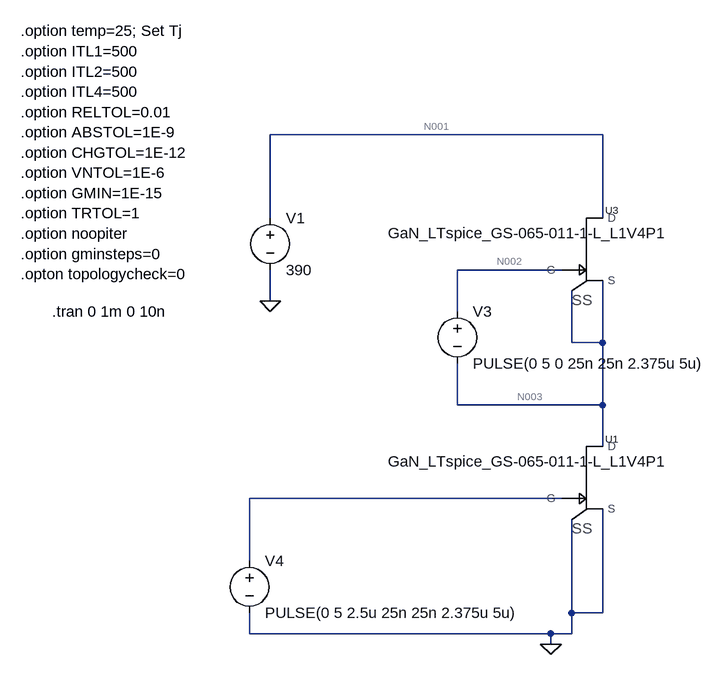
[diagram p0: schematic HB_TEST_GAN.asc]
HB_TEST_GAN.asc, the LTspice schematic file:
Version 4
SHEET 1 880 680
WIRE 320 -256 -192 -256
WIRE -192 -128 -192 -256
WIRE 320 -128 320 -256
WIRE 256 -48 96 -48
WIRE -192 0 -192 -48
WIRE 96 16 96 -48
WIRE 272 64 272 -16
WIRE 320 64 320 -32
WIRE 320 64 272 64
WIRE 96 160 96 96
WIRE 320 160 320 64
WIRE 320 160 96 160
WIRE 320 224 320 160
WIRE 256 304 -224 304
WIRE -224 400 -224 304
WIRE 272 480 272 336
WIRE 320 480 320 320
WIRE 320 480 272 480
WIRE -224 512 -224 480
WIRE 240 512 -224 512
WIRE 272 512 272 480
WIRE 272 512 240 512
WIRE 240 528 240 512
FLAG 240 528 0
FLAG -192 0 0
SYMBOL voltage 96 0 R0
WINDOW 123 0 0 Left 0
WINDOW 39 0 0 Left 0
SYMATTR InstName V3
SYMATTR Value PULSE(0 5 0 25n 25n 2.375u 5u)
SYMBOL voltage -224 384 R0
WINDOW 123 0 0 Left 0
WINDOW 39 0 0 Left 0
SYMATTR InstName V4
SYMATTR Value PULSE(0 5 2.5u 25n 25n 2.375u 5u)
SYMBOL voltage -192 -144 R0
WINDOW 123 0 0 Left 0
WINDOW 39 0 0 Left 0
SYMATTR InstName V1
SYMATTR Value 390
SYMBOL GaNSystems\\GaN_LTspice_GS-065-011-1-L_L1V4P1 272 -80 R0
SYMATTR InstName U3
SYMBOL GaNSystems\\GaN_LTspice_GS-065-011-1-L_L1V4P1 272 272 R0
SYMATTR InstName U1
TEXT -528 16 Left 2 !.tran 0 1m 0 10n
TEXT -576 -416 Left 2 !.option temp=25; Set Tj\n.option ITL1=500\n.option ITL2=500\n.option ITL4=500\n.option RELTOL=0.01\n.option ABSTOL=1E-9\n.option CHGTOL=1E-12\n.option VNTOL=1E-6\n.option GMIN=1E-15\n.option TRTOL=1\n.option noopiter\n.option gminsteps=0\n.opton topologycheck=0

The netlist it stands for:
* HB_TEST_GAN.asc
V3 N002 N003 PULSE(0 5 0 25n 25n 2.375u 5u)
V4 N004 0 PULSE(0 5 2.5u 25n 25n 2.375u 5u)
V1 N001 0 390
XU3 N002 N001 N003 N003 GaN_LTspice_GS-065-011-1-L_L1V4P1  ; pins G D S SS
XU1 N004 N003 0 0 GaN_LTspice_GS-065-011-1-L_L1V4P1  ; pins G D S SS
.tran 0 1m 0 10n
.option temp=25; Set Tj
.option ITL1=500
.option ITL2=500
.option ITL4=500
.option RELTOL=0.01
.option ABSTOL=1E-9
.option CHGTOL=1E-12
.option VNTOL=1E-6
.option GMIN=1E-15
.option TRTOL=1
.option noopiter
.option gminsteps=0
.opton topologycheck=0
.lib GaN_LTspice_GS-065-011-1-L_L1V4P1.lib
.backanno
.end

* Results of the author's LTspice run, read from the files saved beside the schematic
* Operating Point, zero values left out:
*   V(n002) = 195.4 V
*   V(n003) = 195.4 V
*   V(n001) = 390 V
*   I(V1) = -96.7 nA
*   I(V4) = 48.85 nA
*   I(V3) = 48.64 nA
*   Ix(u3:GATEIN) = -48.65 nA
*   Ix(u3:DRAININ) = 96.7 nA
*   Ix(u3:SOURCEIN) = -40.25 nA
*   Ix(u3:SOURCE_S) = -8.509 nA
*   Ix(u1:GATEIN) = -48.85 nA
*   Ix(u1:DRAININ) = 97.41 nA
*   Ix(u1:SOURCEIN) = -40.33 nA
*   Ix(u1:SOURCE_S) = -8.525 nA